# Altium project Test_Board.PrjPcb
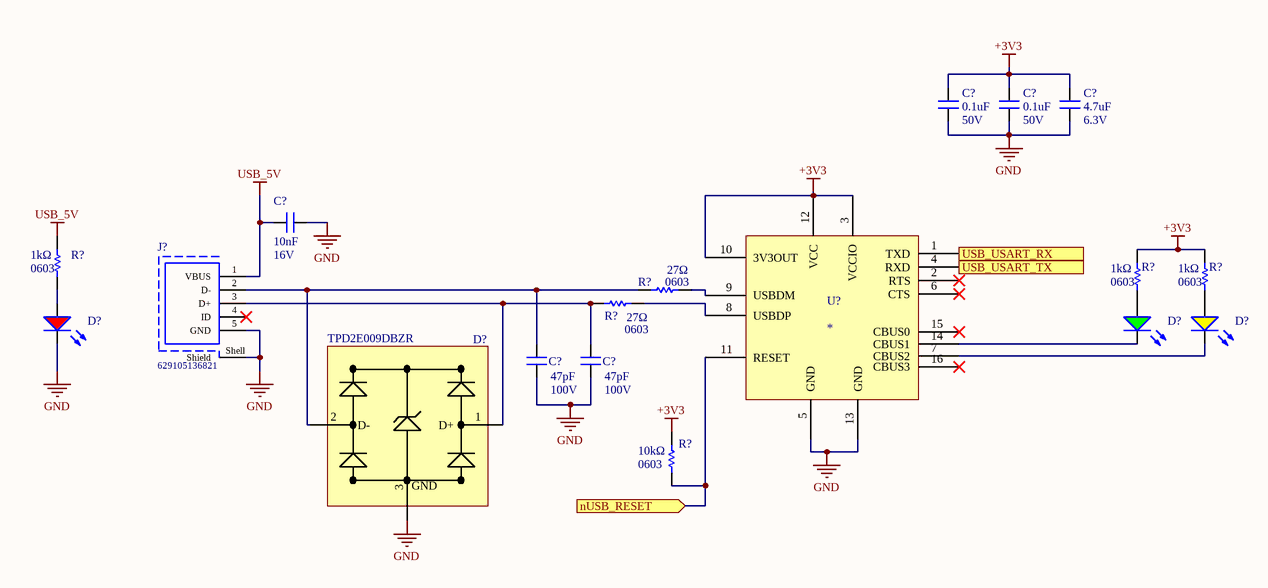
[diagram p0: FTDI.SchDoc]
5 sheets, 33 parts. Net scope: flat (ports and power ports of the same name join across sheets).
Sheets:
  MCU.SchDoc
  FTDI.SchDoc
  POWER.SchDoc
  INDICATORS.SchDoc
  CONTROLS.SchDoc

## Sheet MCU.SchDoc
size Letter

### Notes on the sheet
- Title
- Size:
- Date:
- Letter
- Drawn By:
- Sheet
- of
- File:

## Sheet FTDI.SchDoc
size Letter

### Parts
(Parts that share a designator on the sheet are numbered #1, #2 ... from top to bottom, then left to right.)
C?#1  value 0.1uF  Voltage Rating: 50V  [CAPC0603(1608)55_N]
C?#2  value 0.1uF  Voltage Rating: 50V  [CAPC0603(1608)55_N]
C?#3  value 4.7uF  Voltage Rating: 6.3V  [CAPC0603(1608)55_N]
C?#4  value 10nF  Voltage Rating: 16V  [CAPC0603(1608)55_N]
C?#5  value 47pF  Voltage Rating: 100V  [CAPC1608X87N]
C?#6  value 47pF  Voltage Rating: 100V  [CAPC1608X87N]
D?#1  (no value)  [LED_0805_LINE]
D?#2  (no value)  [LED_0805_LINE]
D?#3  (no value)  [LED_0805_LINE]
D?#4  Manufacturer Part Number: TPD2E009DBZR  [SOT23-3]  (hidden comment: *)
J?  629105136821  [629105136821]
R?#1  value 1kΩ  Case/Package: 0603  [RESC0603(1608)_N]
R?#2  value 1kΩ  Case/Package: 0603  [RESC0603(1608)_N]
R?#3  value 1kΩ  Case/Package: 0603  [RESC0603(1608)_N]
R?#4  Case/Package: 0603  Resistance: 27Ω  [RESC0603(1608)_N]  (hidden comment: *)
R?#5  Case/Package: 0603  Resistance: 27Ω  [RESC0603(1608)_N]  (hidden comment: *)
R?#6  value 10kΩ  Case/Package: 0603  [RESC0603(1608)_N]
U?  *  [SSOP16-0.635-5X4MM]

### Ports
nUSB_RESET (in), USB_USART_RX (out), USB_USART_TX (in)

### Nets
+3V3: C?#1.2 C?#2.2 C?#3.2 R?#2.2 R?#3.2 R?#6.2 U?.3(VCCIO) U?.10(3V3OUT) U?.12(VCC)
GND: C?#1.1 C?#2.1 C?#3.1 C?#4.2 C?#5.1 C?#6.1 D?#1.2(K) D?#4.3(GND) J?.5(GND) J?.Shell(Shield) U?.5(GND) U?.13(GND)
USB_5V: C?#4.1 J?.1(VBUS) R?#1.2
NetC?#5_2: C?#5.2 D?#4.2(D-) J?.2(D-) R?#4.1
NetC?#6_2: C?#6.2 D?#4.1(D+) J?.3(D+) R?#5.1
NetD?#1_1: D?#1.1(A) R?#1.1
NetD?#2_1: D?#2.1(A) R?#2.1
NetD?#2_2: D?#2.2(K) U?.14(CBUS1)
NetD?#3_1: D?#3.1(A) R?#3.1
NetD?#3_2: D?#3.2(K) U?.7(CBUS2)
NetR?#4_2: R?#4.2 U?.9(USBDM)
NetR?#5_2: R?#5.2 U?.8(USBDP)
NetR?#6_1: R?#6.1 U?.11(RESET) ; port nUSB_RESET
NetU?_1: U?.1(TXD) ; port USB_USART_RX
NetU?_4: U?.4(RXD) ; port USB_USART_TX

Not connected (* = marked no-connect by the designer): J? 4(ID)*; U? 2(RTS)* 6(CTS)* 15(CBUS0)* 16(CBUS3)*

### Notes on the sheet
- Title
- Size:
- Date:
- Letter
- Drawn By:
- Sheet
- of
- File:

### Library data of the parts
C?#1 C?#2 = CAP_0.1uF_50V_0603: CAP CER 0.1UF 50V X7R 0603; Manufacturer Part Number 1: CC0603KRX7R9BB104; Manufacturer 1: Yageo; Dimensions: 0.063" L x 0.031" W (1.60mm x 0.80mm); Package: 0603 (1608 Metric); Temperature Coefficient: X7R; Supplier Part Number 1: 311-1344-1-ND; Supplier 1: Digi-Key; Mount: Surface Mount
C?#3 = CAP_4.7uF_0603: CAP CER 4.7UF 6.3V X5R 0603; Manufacturer Part Number 1: CC0603KRX5R5BB475; Manufacturer 1: Yageo; Dimensions: 0.063" L x 0.031" W (1.60mm x 0.80mm); Package: 0603 (1608 Metric); Temperature Coefficient: X5R; Supplier Part Number 1: 311-1521-1-ND; Supplier 1: Digi-Key; Mount: Surface Mount
C?#4 = CAP_10nF_0603: CAP CER 10000PF 16V X7R 0603; Manufacturer Part Number 1: CC0603KRX7R7BB103; Manufacturer 1: Yageo; Dimensions: 0.063" L x 0.031" W (1.60mm x 0.80mm); Package: 0603 (1608 Metric); Temperature Coefficient: X7R; Supplier Part Number 1: 311-3369-1-ND; Supplier 1: Digi-Key; Mount: Surface Mount
C?#5 C?#6 = CAP_47pF_100V_0603: CAP CER 47PF 100V C0G/NP0 0603; Manufacturer Part Number 1: C0603C470J1GACTU; Manufacturer 1: KEMET; Temperature Coefficient: C0G; Dimensions: 0.063" L x 0.031" W (1.60mm x 0.80mm); Package: 0603 (1608 Metric); Supplier Part Number 1: 399-7917-1-ND; Supplier 1: Digi-Key; Mount: Surface Mount
D?#1 = DIO_LED_R: LED RED DIFFUSED 0805 SMD; Manufacturer Part Number 1: LS R976-NR-1; Manufacturer 1: OSRAM; Forward Voltage Drop: 2V; Package: 0805 (2012 Metric); Supplier Part Number 1: 475-1278-1-ND; Supplier 1: Digi-Key; Mount: Surface Mount
D?#2 = DIO_LED_G: LED GREEN DIFFUSED 0805 SMD; Manufacturer Part Number 1: LG R971-KN-1; Manufacturer 1: OSRAM; Forward Voltage Drop: 2.2V; Package: 0805 (2012 Metric); Supplier Part Number 1: 475-1410-1-ND; Supplier 1: Digi-Key; Mount: Surface Mount
D?#3 = DIO_LED_Y: LED YELLOW DIFFUSED 0805 SMD; Manufacturer Part Number 1: LY R976-PS-36; Manufacturer 1: OSRAM; Forward Voltage Drop: 2.2V; Package: 0805 (2012 Metric); Supplier Part Number 1: 475-2560-1-ND; Supplier 1: Digi-Key; Mount: Surface Mount
D?#4 = TVS_DIODE_USB_5.5V: ESD Suppressor Diode Arrays 8KV 3-Pin SOT-23 T/R; Manufacturer: Texas Instruments; Direction: Unidirectional; Operating Supply Voltage: 6V; Capacitance: 0.9pF; Number of Channels: 2; Current Rating: 100nA; Peak Pulse Current: 1A; Element Configuration: Dual; Reverse Standoff Voltage: 5.5V; Min Breakdown Voltage: 9V; Clamping Voltage: 8V; Peak Pulse Power: 45W; Power Line Protection: Yes; Breakdown Voltage: 7V; Interface: LVDS,PCIe,SATA; Supplier 1: Digi-Key; RoHS: Yes; Category: Interface ICs; Stock 1: 98615; Pricing 1: 1=0.56000, 10=0.48000, 25=0.44800, 100=0.33280, 250=0.31616, 500=0.25984, 1000=0.21120 (USD); Case/Package: SOT-23; Number of Pins: 3; Min Operating Temperature: -40°C; Max Operating Temperature: 85°C; Packaging: Tape and Reel; Package Quantity: 1; Number of Bidirectional Channels: 2; Termination: SMD/SMT; Max Power Dissipation: 45W; Working Voltage: 5.5V; Length: 2.92mm; Height: 1mm; Width: 1.3mm; Depth: 1.3mm; Radiation Hardening: No; REACH SVHC: No SVHC; Lead Free: Lead Free; ComponentLink1URL: https://datasheet.ciiva.com/353/tpd2e009-353266.pdf?src-supplier=Digi-Key; ComponentLink1Description: https://datasheet.ciiva.com/353/tpd2e009-353266.pdf?src-supplier=Digi-Key; ComponentLink2URL: https://datasheet.ciiva.com/15134/getdatasheetpartid-243395-15134537.pdf?src-supplier=Verical; ComponentLink2Description: https://datasheet.ciiva.com/15134/getdatasheetpartid-243395-15134537.pdf?src-supplier=Verical; ComponentLink3URL: https://datasheet.ciiva.com/4479/slvs953a-121037-4479453.pdf?src-supplier=Mouser; ComponentLink3Description: https://datasheet.ciiva.com/4479/slvs953a-121037-4479453.pdf?src-supplier=Mouser; ComponentLink4URL: https://datasheet.ciiva.com/353/tpd2e009-353268.pdf?src-supplier=Digi-Key; ComponentLink4Description: https://datasheet.ciiva.com/353/tpd2e009-353268.pdf?src-supplier=Digi-Key; ComponentLink5URL: https://datasheet.ciiva.com/353/tpd2e009-353267.pdf?src-supplier=Digi-Key; ComponentLink5Description: https://datasheet.ciiva.com/353/tpd2e009-353267.pdf?src-supplier=Digi-Key; ComponentLink6URL: https://datasheet.ciiva.com/46384/1707898-46384524.pdf?src-supplier=Element14; ComponentLink6Description: https://datasheet.ciiva.com/46384/1707898-46384524.pdf?src-supplier=Element14; Supplier Part Number 1: 296-24657-1-ND
J? = CMP-1502-03253-1: Micro USB 2.0 Type B Receptacle WR-COM, Horizontal, SMT, with Pads and Pegs; Manufacturer: Wurth Elektronik; Contact Resistance: 30mOhm; Rated Current: 1A; Working Voltage: 30VAC; Datasheet URL: https://katalog.we-online.de/em/datasheet/629105136821.pdf; Mounting Technology: SMT; Publisher: WurthElektronik; Package Reference: 629105136821; Orientation: Horizontal; Packaging: TapeandReel; Part Number: 629105136821; Manufacturer URL: http://www.we-online.de; Connector Type: MicroUSB2.0TypeB; Gender: Receptacle; Operating Temperature: -40to105degC
R?#1-R?#3 = RES_1kΩ_0603: RES SMD 1K OHM 5% 1/10W 0603; Manufacturer 1: Yageo; Manufacturer Part Number 1: RC0603JR-071KL; Dimensions: 0.063" L x 0.031" W (1.60mm x 0.80mm); Package: 0603 (1608 Metric); Supplier Part Number 1: 311-1.0KGRCT-ND; Supplier 1: Digi-Key; Mount: Surface Mount; Case Code (Metric): 1608; Tolerance: 5%
R?#4 R?#5 = RES_27Ω_0603: RES SMD 27 OHM 5% 1/10W 0603; Manufacturer: Yageo; Manufacturer Part Number 1: RC0603JR-0727RL; Voltage Rating (DC): 50V; Power Rating: 100mW; Temperature Coefficient: 100ppm/°C; Value: 27Ω; Supplier 1: Digi-Key; RoHS: Yes; Category: Chip SMD Resistors; Stock 1: 2055343; Pricing 1: 1=0.10000, 10=0.01900, 100=0.00770, 1000=0.00347, 2500=0.00301 (USD); Number of Pins: 2; Min Operating Temperature: -55°C; Max Operating Temperature: 155°C; Voltage Rating: 50V; Packaging: Tape and Reel; Termination: SMD/SMT; Composition: Thick Film; Military Standard: Not; Length: 1.6mm; Width: 0.8mm; Depth: 0.8mm; Lead Free: Lead Free; REACH SVHC: No SVHC; ComponentLink1URL: https://datasheet.ciiva.com/7746/443971-7746479.pdf?src-supplier=Element14; ComponentLink1Description: https://datasheet.ciiva.com/7746/443971-7746479.pdf?src-supplier=Element14; Supplier Part Number 1: 311-27GRCT-ND; Dimensions: 0.063" L x 0.031" W (1.60mm x 0.80mm); Mount: Surface Mount; Package: 0603 (1608 Metric); Case Code (Metric): 1608; Tolerance: 5%
R?#6 = RES_10kΩ_0603: RES SMD 10K OHM 5% 1/10W 0603; Manufacturer 1: Yageo; Manufacturer Part Number 1: RC0603JR-0710KL; Package: 0603 (1608 Metric); Dimensions: 0.063" L x 0.031" W (1.60mm x 0.80mm); Supplier Part Number 1: 311-10KGRCT-ND; Supplier 1: Digi-Key; Mount: Surface Mount; Case Code (Metric): 1608; Tolerance: 5%
U? = IC_USB_TRANSCEIVER: Manufacturer 1: FTDI, Future Technology Devices International Ltd; Manufacturer Part Number 1: FT230XS-R; Supplier 1: Digi-Key; Supplier Part Number 1: 768-1135-1-ND

## Sheet POWER.SchDoc
size Letter
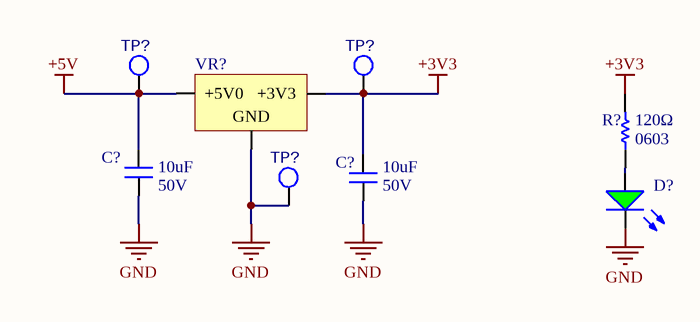
[diagram p1: POWER.SchDoc]

### Parts
(Parts that share a designator on the sheet are numbered #1, #2 ... from top to bottom, then left to right.)
C?#7  Voltage Rating: 50V  [CAPC1206(3216)]  (hidden comment: 10uF)
C?#8  Voltage Rating: 50V  [CAPC1206(3216)]  (hidden comment: 10uF)
D?#5  (no value)  [LED_0805_LINE]
R?#7  value 120Ω  Case/Package: 0603  [RESC0603(1608)_N]
TP?#1  *  [TESTPOINT_LOOP]  (value not drawn)
TP?#2  *  [TESTPOINT_LOOP]  (value not drawn)
TP?#3  *  [TESTPOINT_LOOP]  (value not drawn)
VR?  (no value)  [D2PAK_M]

### Nets
+3V3: C?#8.2 R?#7.2 TP?#2.1 VR?.2(+3V3)
+5V: C?#7.1 TP?#1.1 VR?.3(+5V0)
GND: C?#7.2 C?#8.1 D?#5.2(K) TP?#3.1 VR?.1(GND)
NetD?#5_1: D?#5.1(A) R?#7.1

### Notes on the sheet
- Title
- Size:
- Date:
- Letter
- Drawn By:
- Sheet
- of
- File:

### Library data of the parts
C?#7 C?#8 = CAP_10uF_50V_1206: CAP CER 10UF 50V X5R 1206; Manufacturer Part Numer 1: GRT31CR61H106KE01L; Manufacturer 1: Murata; Dimensions: 0.126" L x 0.063" W (3.20mm x 1.6mm); Package: 1206 (3216 Metric); Supplier Part Number 1: 490-12456-1-ND; Supplier 1: Digi-Key; Mount: Surface Mount; Value: 10uF
D?#5 = DIO_LED_G: as D?#2 on sheet FTDI; Package: 0805 (2012 Metric); Supplier Part Number 1: 475-1410-1-ND; Supplier 1: Digi-Key; Mount: Surface Mount
R?#7 = RES_120Ω_0603: RES SMD 120 OHM 5% 1/10W 0603; Manufacturer 1: Yageo; Manufacturer Part Number 1: RC0603JR-07120RL; Package: 0603 (1608 Metric); Dimensions: 0.063" L x 0.031" W (1.60mm x 0.80mm); Supplier Part Number 1: 311-120GRCT-ND; Supplier 1: Digi-Key; Mount: Surface Mount; Case Code (Metric): 1608; Tolerance: 5%
TP?#1-TP?#3 = TESTPOINT_LOOP: Loop testpoint through-hole pad; Manufacturer 1: Keystone Electronics; Manufacturer Part Number 1: 5002; Supplier Part Number 1: 36-5002-ND; Supplier 1: Digi-Key; Mount: Through Hole
VR? = 5V0_3V3_LDO: IC REG LINEAR 3.3V 1A DPAK; Manufacturer Part Number 1: NCP1117DT33T5G; Manufacturer 1: ON Semiconductor; Current Output: 1A; Supplier Part Number 1: NCP1117DT33T5GOSCT-ND; Supplier 1: Digi-Key; Mount: Surface Mount

## Sheet INDICATORS.SchDoc
size Letter
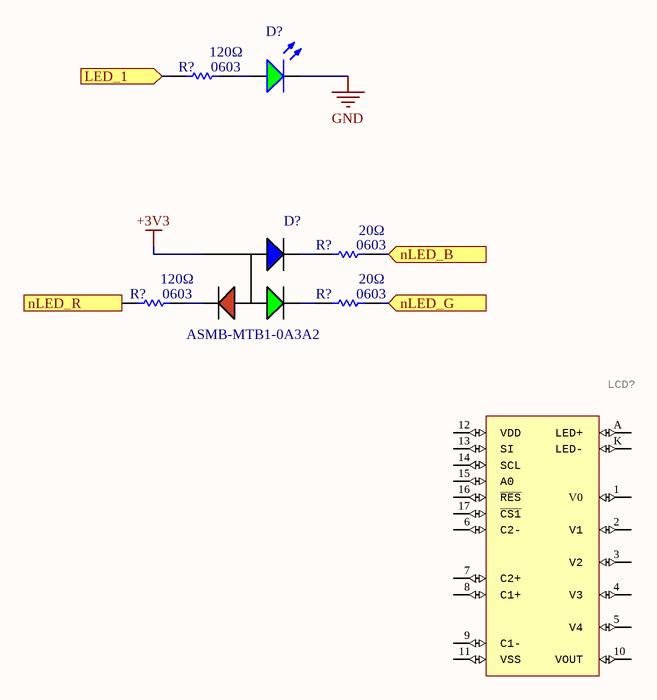
[diagram p2: INDICATORS.SchDoc]

### Parts
(Parts that share a designator on the sheet are numbered #1, #2 ... from top to bottom, then left to right.)
D?#6  (no value)  [LED_0805_LINE]
D?#7  Manufacturer Part Number 1: ASMB-MTB1-0A3A2  [LED_RGB]  (hidden comment: *)
LCD?  (no value)  [NHDC12832A1ZFSWFBW3V3]
R?#8  value 120Ω  Case/Package: 0603  [RESC0603(1608)_N]
R?#9  value 20Ω  Case/Package: 0603  [RESC0603(1608)_N]
R?#10  value 120Ω  Case/Package: 0603  [RESC0603(1608)_N]
R?#11  value 20Ω  Case/Package: 0603  [RESC0603(1608)_N]

### Ports
LED_1 (in), nLED_B (in), nLED_G (in), nLED_R (in)

### Nets
+3V3: D?#7.4
GND: D?#6.2(K)
NetD?#6_1: D?#6.1(A) R?#8.2
NetD?#7_1: D?#7.1 R?#10.2
NetD?#7_2: D?#7.2 R?#11.1
NetD?#7_3: D?#7.3 R?#9.1
NetR?#8_1: R?#8.1 ; port LED_1
NetR?#9_2: R?#9.2 ; port nLED_B
NetR?#10_1: R?#10.1 ; port nLED_R
NetR?#11_2: R?#11.2 ; port nLED_G

Not connected (* = marked no-connect by the designer): LCD? 1(V0) 2(V1) 3(V2) 4(V3) 5(V4) 6(C2-) 7(C2+) 8(C1+) 9(C1-) 10(VOUT) 11(VSS) 12(VDD) 13(SI) 14(SCL) 15(A0) 16(~{RES}) 17(~{CS1}) A(LED+) K(LED-)

### Notes on the sheet
- Title
- Size:
- Date:
- Letter
- Drawn By:
- Sheet
- of
- File:

### Library data of the parts
D?#6 = DIO_LED_G: as D?#2 on sheet FTDI; Package: 0805 (2012 Metric); Supplier Part Number 1: 475-1410-1-ND; Supplier 1: Digi-Key; Mount: Surface Mount
D?#7 = LED_RGB: LED RGB DIFFUSED 4PLCC SMD; Manufacturer 1: Broadcom; Color: Blue,Green,Red; Lens Color: White; Viewing Angle: 115°; Lens Style: Round; Luminous Intensity: 350mcd; Dominant Wavelength: 470nm; Forward Voltage: 3.1V; Test Current: 20mA; Supplier 1: Digi-Key; Stock 1: 142531; Pricing 1: 1=0.60000, 10=0.47100, 100=0.30210, 500=0.25980, 1000=0.20059 (USD); RoHS: Yes; Mount: Surface Mount; Case/Package: PLCC; Number of Pins: 4; Packaging: Cut Tape; Lens Transparency: Diffused; Length: 3.2mm; Height: 1.9mm; Width: 2.8mm; REACH SVHC: No SVHC; ComponentLink1URL: http://www.farnell.com/datasheets/2111106.pdf?src-supplier=Farnell; ComponentLink1Description: http://www.farnell.com/datasheets/2111106.pdf?src-supplier=Farnell; ComponentLink2URL: https://docs.broadcom.com/docs/AV02-4194EN?src-supplier=Digi-Key; ComponentLink2Description: https://docs.broadcom.com/docs/AV02-4194EN?src-supplier=Digi-Key; ComponentLink3URL: http://www.farnell.com/datasheets/1801564.pdf?src-supplier=Element14; ComponentLink3Description: http://www.farnell.com/datasheets/1801564.pdf?src-supplier=Element14; ComponentLink4URL: http://www.farnell.com/datasheets/2111106.pdf?src-supplier=Newark; ComponentLink4Description: http://www.farnell.com/datasheets/2111106.pdf?src-supplier=Newark; Supplier Part Number 1: 516-3280-1-ND
LCD? = NHD-C12832A1Z-FSW-FBW-3V3: LCD COG GRAPHIC 128X32; Manufacturer 1: Newhaven Display Intl; Supplier 1: Digi-Key; Supplier Part Number 1: NHD-C12832A1Z-FSW-FBW-3V3-ND; Manufacturer Part Number 1: NHD-C12832A1Z-FSW-FBW-3V3
R?#8 R?#10 = RES_120Ω_0603: as R?#7 on sheet POWER; Package: 0603 (1608 Metric); Dimensions: 0.063" L x 0.031" W (1.60mm x 0.80mm); Supplier Part Number 1: 311-120GRCT-ND; Supplier 1: Digi-Key; Mount: Surface Mount; Case Code (Metric): 1608; Tolerance: 5%
R?#9 R?#11 = RES_20Ω_0603: RES SMD 20 OHM 5% 1/10W 0603; Manufacturer 1: Yageo; Manufacturer Part Number 1: RC0603JR-0720RL; Package: 0603 (1608 Metric); Dimensions: 0.063" L x 0.031" W (1.60mm x 0.80mm); Supplier Part Number 1: 311-20GRCT-ND; Supplier 1: Digi-Key; Mount: Surface Mount; Case Code (Metric): 1608; Tolerance: 5%

## Sheet CONTROLS.SchDoc
size Letter

### Notes on the sheet
- Title
- Size:
- Date:
- Letter
- Drawn By:
- Sheet
- of
- File:

## Nets that join several sheets
+3V3: FTDI (9 pins), POWER (C?#8.2 R?#7.2 TP?#2.1 VR?.2), INDICATORS (D?#7.4)
GND: FTDI (12 pins), POWER (5 pins), INDICATORS (D?#6.2)